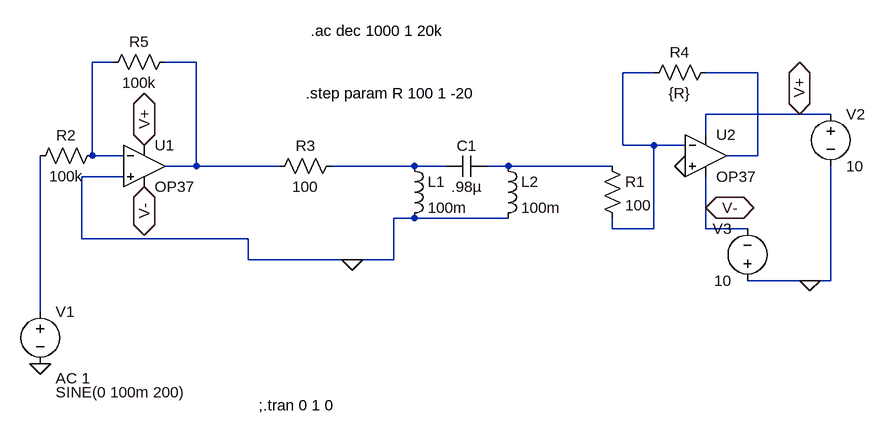
[diagram p0: schematic HighPass.asc]
HighPass.asc, the LTspice schematic file:
Version 4
SHEET 1 1036 680
WIRE -128 112 -160 112
WIRE 0 112 -48 112
WIRE 704 128 656 128
WIRE 864 128 784 128
WIRE 928 192 784 192
WIRE 976 192 928 192
WIRE 784 224 784 192
WIRE 656 240 656 128
WIRE 704 240 656 240
WIRE 752 240 704 240
WIRE -160 256 -160 112
WIRE -112 256 -160 256
WIRE 864 256 864 128
WIRE 864 256 816 256
WIRE 0 272 0 112
WIRE 0 272 -48 272
WIRE 128 272 0 272
WIRE 336 272 208 272
WIRE 384 272 336 272
WIRE 480 272 448 272
WIRE 640 272 480 272
WIRE -112 288 -176 288
WIRE 784 336 784 288
WIRE 336 352 304 352
WIRE 480 352 336 352
WIRE 640 368 640 352
WIRE 704 368 704 240
WIRE 704 368 640 368
WIRE 784 368 784 336
WIRE 848 368 784 368
WIRE -176 384 -176 288
WIRE 80 384 -176 384
WIRE 80 416 80 384
WIRE 240 416 80 416
WIRE 304 416 304 352
WIRE 304 416 240 416
WIRE 944 448 848 448
WIRE 976 448 976 272
WIRE 976 448 944 448
WIRE -240 496 -240 256
FLAG 240 416 0
FLAG 944 448 0
FLAG 928 192 V+
IOPIN 928 192 BiDir
FLAG 784 336 V-
IOPIN 784 336 BiDir
FLAG -80 240 V+
IOPIN -80 240 BiDir
FLAG -80 304 V-
IOPIN -80 304 BiDir
FLAG -240 576 0
FLAG 752 272 0
SYMBOL res 624 256 R0
SYMATTR InstName R1
SYMATTR Value 100
SYMBOL res 688 144 R270
WINDOW 0 32 56 VTop 2
WINDOW 3 0 56 VBottom 2
SYMATTR InstName R4
SYMATTR Value {R}
SYMBOL Opamps/OP37 784 192 R0
SYMATTR InstName U2
SYMBOL voltage 976 176 R0
SYMATTR InstName V2
SYMATTR Value 10
SYMBOL voltage 848 464 R180
WINDOW 0 24 96 Left 2
WINDOW 3 24 16 Left 2
SYMATTR InstName V3
SYMATTR Value 10
SYMBOL Opamps/OP37 -80 208 R0
SYMATTR InstName U1
SYMBOL res -144 240 R90
WINDOW 0 0 56 VBottom 2
WINDOW 3 32 56 VTop 2
SYMATTR InstName R2
SYMATTR Value 100k
SYMBOL res -32 96 R90
WINDOW 0 0 56 VBottom 2
WINDOW 3 32 56 VTop 2
SYMATTR InstName R5
SYMATTR Value 100k
SYMBOL voltage -240 480 R0
WINDOW 3 24 140 Left 2
WINDOW 123 24 118 Left 2
SYMATTR Value SINE(0 100m 200)
SYMATTR Value2 AC 1
SYMATTR InstName V1
SYMBOL cap 448 256 R90
WINDOW 0 0 32 VBottom 2
WINDOW 3 32 32 VTop 2
SYMATTR InstName C1
SYMATTR Value .98µ
SYMBOL ind 320 256 R0
SYMATTR InstName L1
SYMATTR Value 100m
SYMBOL ind 464 256 R0
SYMATTR InstName L2
SYMATTR Value 100m
SYMBOL res 224 256 R90
WINDOW 0 0 56 VBottom 2
WINDOW 3 32 56 VTop 2
SYMATTR InstName R3
SYMATTR Value 100
TEXT 176 64 Left 2 !.ac dec 1000 1 20k
TEXT 96 640 Left 2 !;.tran 0 1 0
TEXT 168 160 Left 2 !.step param R 100 1 -20

The netlist it stands for:
* HighPass.asc
R1 N006 N003 100
R4 N003 N004 {R}
XU2 0 N003 V+ V- N004 LT1037  ; OP37, pins In+ In- V+ V- OUT
V2 V+ 0 10
V3 0 V- 10
XU1 0 N001 V+ V- N002 LT1037  ; OP37, pins In+ In- V+ V- OUT
R2 N001 N007 100k
R5 N002 N001 100k
V1 N007 0 SINE(0 100m 200) AC 1
C1 N006 N005 .98µ
L1 N005 0 100m
L2 N006 0 100m
R3 N005 N002 100
.ac dec 1000 1 20k
;.tran 0 1 0
.step param R 100 1 -20
.lib LTC.lib
.backanno
.end